# EAGLE design parallelmonitor (EAGLE 6.2)
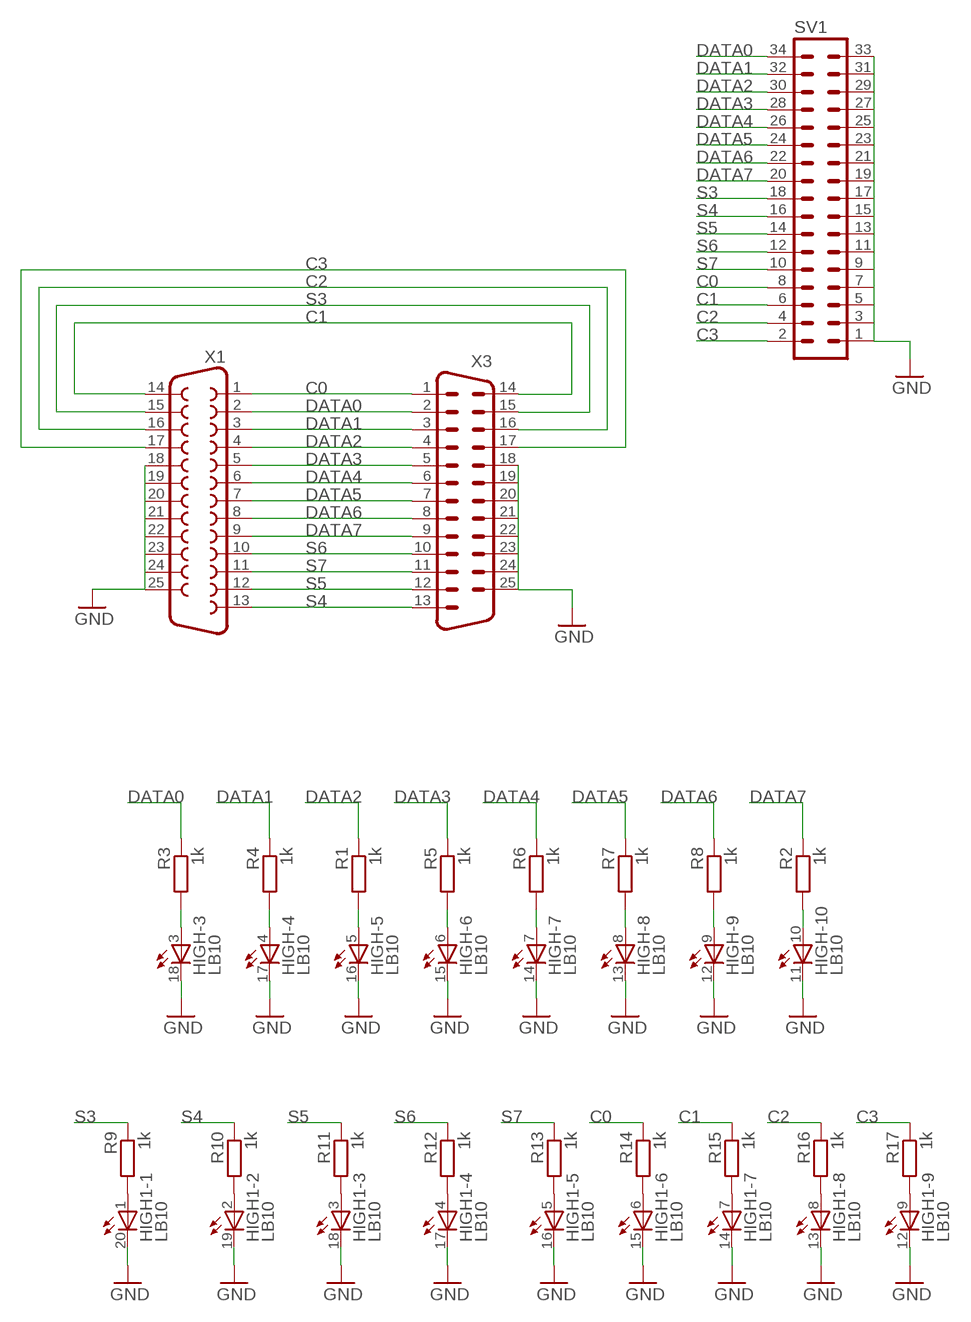
[diagram p0: schematic, sheet 1]

## Parts
HIGH  LB10  [LB10]
HIGH1  LB10  [LB10]
R1  1k  R-EU_M0805  [M0805]
R2  1k  R-EU_M0805  [M0805]
R3  1k  R-EU_M0805  [M0805]
R4  1k  R-EU_M0805  [M0805]
R5  1k  R-EU_M0805  [M0805]
R6  1k  R-EU_M0805  [M0805]
R7  1k  R-EU_M0805  [M0805]
R8  1k  R-EU_M0805  [M0805]
R9  1k  R-EU_M0805  [M0805]
R10  1k  R-EU_M0805  [M0805]
R11  1k  R-EU_M0805  [M0805]
R12  1k  R-EU_M0805  [M0805]
R13  1k  R-EU_M0805  [M0805]
R14  1k  R-EU_M0805  [M0805]
R15  1k  R-EU_M0805  [M0805]
R16  1k  R-EU_M0805  [M0805]
R17  1k  R-EU_M0805  [M0805]
SV1  MA17-2W  [MA17-2W]
X1  F25D  [F25D]
X3  M25D  [M25D]

## Nets
C0: R14.1 SV1.8 X1.1 X3.1
C1: R15.1 SV1.6 X1.14 X3.14
C2: R16.1 SV1.4 X1.16 X3.16
C3: R17.1 SV1.2 X1.17 X3.17
DATA0: R3.1 SV1.34 X1.2 X3.2
DATA1: R4.1 SV1.32 X1.3 X3.3
DATA2: R1.1 SV1.30 X1.4 X3.4
DATA3: R5.1 SV1.28 X1.5 X3.5
DATA4: R6.1 SV1.26 X1.6 X3.6
DATA5: R7.1 SV1.24 X1.7 X3.7
DATA6: R8.1 SV1.22 X1.8 X3.8
DATA7: R2.1 SV1.20 X1.9 X3.9
GND: HIGH1.12(-9:C) HIGH1.13(-8:C) HIGH1.14(-7:C) HIGH1.15(-6:C) HIGH1.16(-5:C) HIGH1.17(-4:C) HIGH1.18(-3:C) HIGH1.19(-2:C) HIGH1.20(-1:C) HIGH.11(-10:C) HIGH.12(-9:C) HIGH.13(-8:C) HIGH.14(-7:C) HIGH.15(-6:C) HIGH.16(-5:C) HIGH.17(-4:C) HIGH.18(-3:C) SV1.1 SV1.3 SV1.5 SV1.7 SV1.9 SV1.11 SV1.13 SV1.15 SV1.17 SV1.19 SV1.21 SV1.23 SV1.25 SV1.27 SV1.29 SV1.31 SV1.33 X1.18 X1.19 X1.20 X1.21 X1.22 X1.23 X1.24 X1.25 X3.18 X3.19 X3.20 X3.21 X3.22 X3.23 X3.24 X3.25
N$1: HIGH.10(-10:A) R2.2
N$2: HIGH1.1(-1:A) R9.2
N$3: HIGH.3(-3:A) R3.2
N$4: HIGH.4(-4:A) R4.2
N$5: HIGH.6(-6:A) R5.2
N$6: HIGH.5(-5:A) R1.2
N$7: HIGH.7(-7:A) R6.2
N$8: HIGH.8(-8:A) R7.2
N$9: HIGH.9(-9:A) R8.2
N$10: HIGH1.2(-2:A) R10.2
N$11: HIGH1.3(-3:A) R11.2
N$12: HIGH1.4(-4:A) R12.2
N$13: HIGH1.5(-5:A) R13.2
N$14: HIGH1.6(-6:A) R14.2
N$15: HIGH1.7(-7:A) R15.2
N$16: HIGH1.8(-8:A) R16.2
N$17: HIGH1.9(-9:A) R17.2
S3: R9.1 SV1.18 X1.15 X3.15
S4: R10.1 SV1.16 X1.13 X3.13
S5: R11.1 SV1.14 X1.12 X3.12
S6: R12.1 SV1.12 X1.10 X3.10
S7: R13.1 SV1.10 X1.11 X3.11
Unconnected: HIGH1.10(-10:A) HIGH1.11(-10:C) HIGH.1(-1:A) HIGH.2(-2:A) HIGH.19(-2:C) HIGH.20(-1:C)

## Library data of the parts
HIGH HIGH1 = led:LB10: LED BLOCK 10-LED bar graph, DIL, Siemens
R1-R17 = rcl:R-EU_: RESISTOR, European symbol
SV1 = con-lstb:MA17-2W: PIN HEADER
X1 = con-subd:F25: SUB-D
X3 = con-subd:M25: SUB-D

## Board
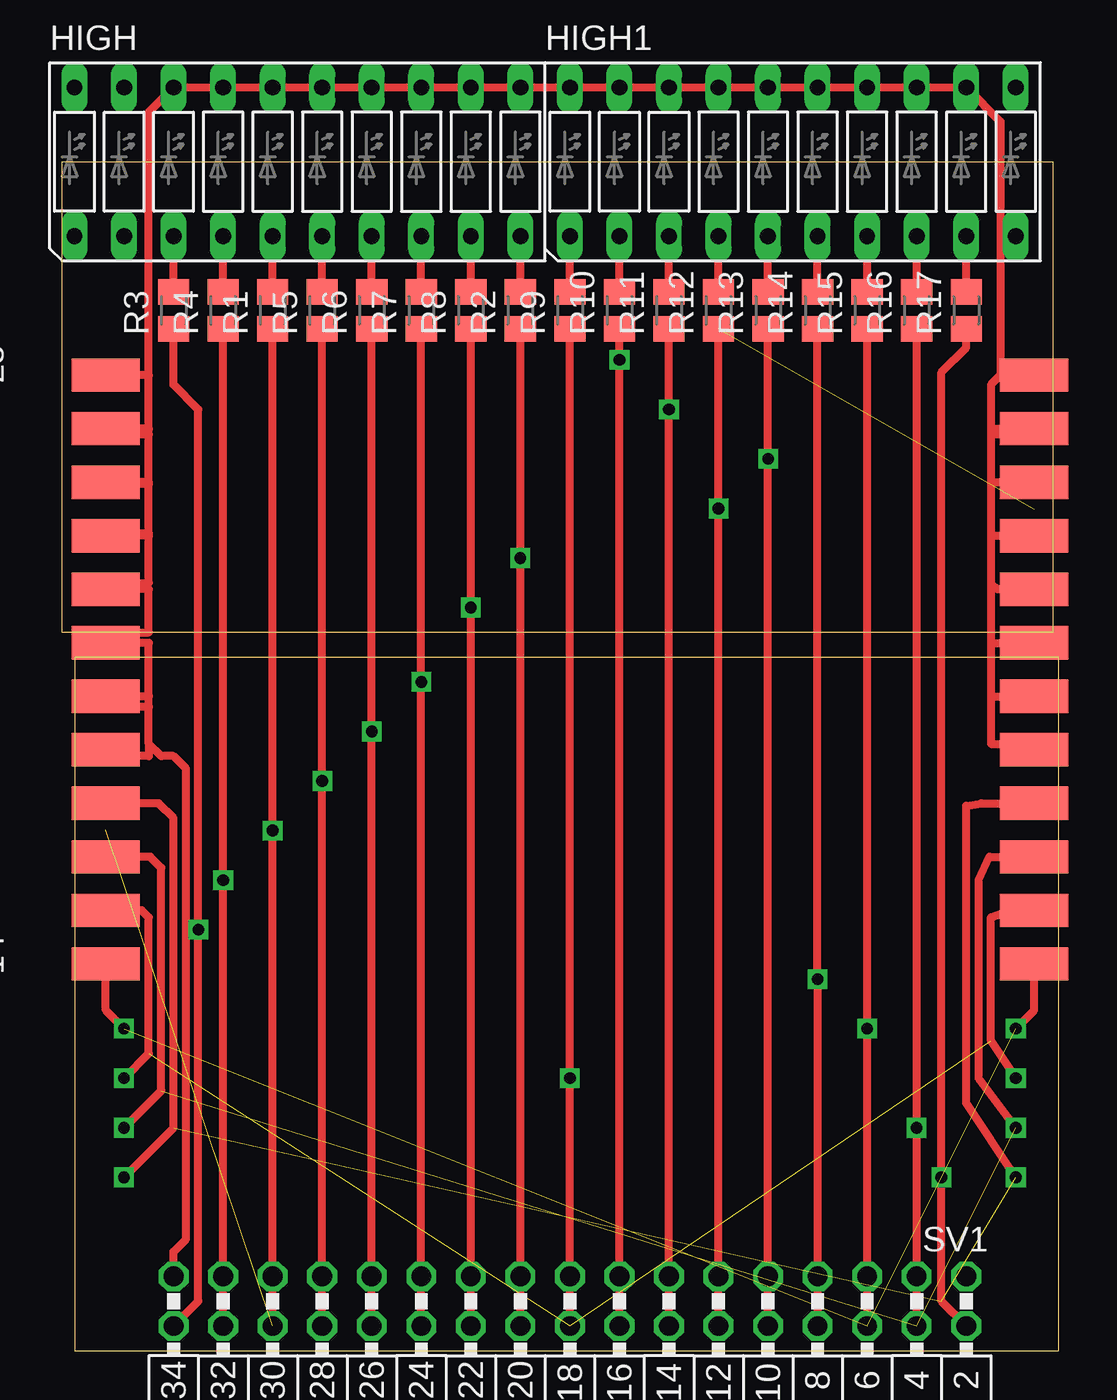
[diagram p1: board, top side]
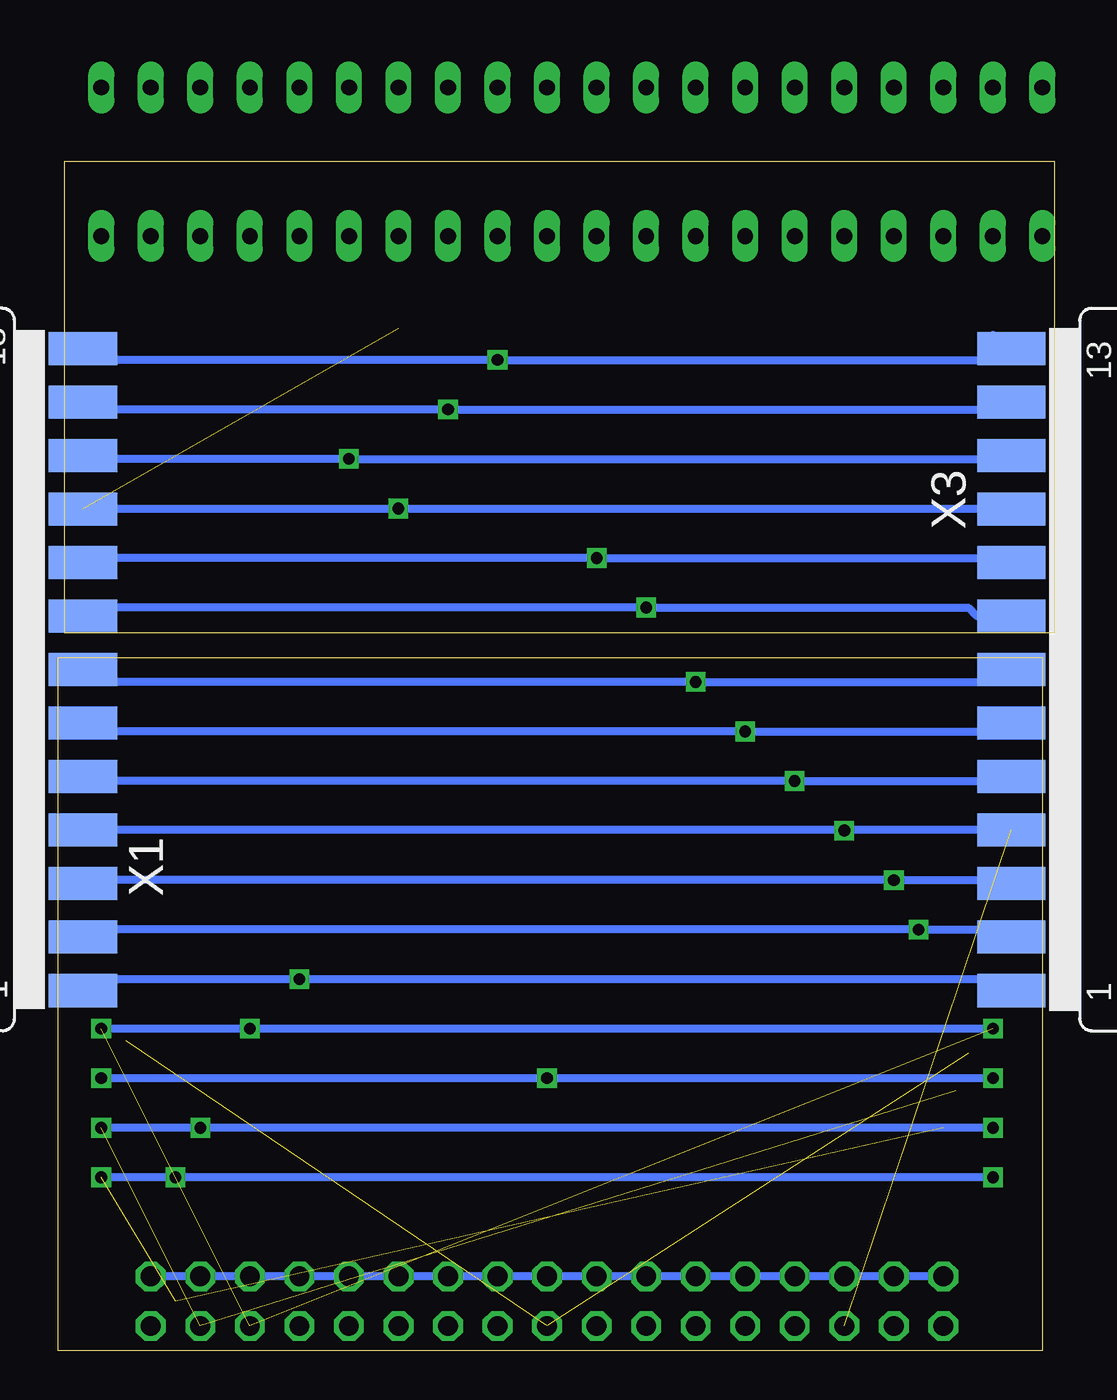
[diagram p2: board, bottom side, seen from below]

Size 51.1 x 60.96 mm. Coordinates in mm from the lower left corner, seen from the top.
Outline: 0.64,0 51.1,0 51.1,35.55 0.64,35.55 0.64,0
Outline: 0,60.96 50.8,60.96 50.8,36.83 0,36.83 0,60.96
Copper layers (1*16): Top 0.035mm / dielectric 1.5mm / Bottom 0.035mm
Design rules "default": minimum track width 10mil, minimum drill 24mil, track to track 8mil, track to pad 8mil, pad to pad 8mil, via to via 8mil, smd to smd 8mil, copper to edge 40mil, drill to drill 8mil, minimum pad ring 10mil, minimum via ring 8mil, stop-mask expansion 4mil, vias tented up to drill 0mil, thermal gap 10mil

### Footprints (pad centres in the part's own frame; a part is rotated, then mirrored left to right if it is on the bottom)
LB10 = drill 0.813 long: 1 -11.43,-3.81; 2 -8.89,-3.81; 3 -6.35,-3.81; 4 -3.81,-3.81; 5 -1.27,-3.81; 6 1.27,-3.81; 7 3.81,-3.81; 8 6.35,-3.81; 9 8.89,-3.81; 10 11.43,-3.81; 11 11.43,3.81; 12 8.89,3.81; 13 6.35,3.81; 14 3.81,3.81; 15 1.27,3.81; 16 -1.27,3.81; 17 -3.81,3.81; 18 -6.35,3.81; 19 -8.89,3.81; 20 -11.43,3.81
M0805 = smd 1.3 x 1.6: 1 -0.95,0; 2 0.95,0
MA17-2W = drill 1.016 octagon: 1 -20.32,-1.27; 2 -20.32,1.27; 3 -17.78,-1.27; 4 -17.78,1.27; 5 -15.24,-1.27; 6 -15.24,1.27; 7 -12.7,-1.27; 8 -12.7,1.27; 9 -10.16,-1.27; 10 -10.16,1.27; 11 -7.62,-1.27; 12 -7.62,1.27; 13 -5.08,-1.27; 14 -5.08,1.27; 15 -2.54,-1.27; 16 -2.54,1.27; 17 0,-1.27; 18 0,1.27; 19 2.54,-1.27; 20 2.54,1.27; 21 5.08,-1.27; 22 5.08,1.27; 23 7.62,-1.27; 24 7.62,1.27; 25 10.16,-1.27; 26 10.16,1.27; 27 12.7,-1.27; 28 12.7,1.27; 29 15.24,-1.27; 30 15.24,1.27; 31 17.78,-1.27; 32 17.78,1.27; 33 20.32,-1.27; 34 20.32,1.27
F25D = smd 1.7 x 3.5: 1 -16.459,-6.045; 2 -13.716,-6.045; 3 -10.973,-6.045; 4 -8.23,-6.045; 5 -5.486,-6.045; 6 -2.743,-6.045; 7 0,-6.045; 8 2.743,-6.045; 9 5.486,-6.045; 10 8.23,-6.045; 11 10.973,-6.045; 12 13.716,-6.045; 13 16.459,-6.045 | smd 1.7 x 3.5 bottom: 14 -15.088,-6.045; 15 -12.344,-6.045; 16 -9.601,-6.045; 17 -6.858,-6.045; 18 -4.115,-6.045; 19 -1.372,-6.045; 20 1.372,-6.045; 21 4.115,-6.045; 22 6.858,-6.045; 23 9.601,-6.045; 24 12.344,-6.045; 25 15.088,-6.045
M25D = smd 1.7 x 3.5: 1 16.459,-6.045; 2 13.716,-6.045; 3 10.973,-6.045; 4 8.23,-6.045; 5 5.486,-6.045; 6 2.743,-6.045; 7 0,-6.045; 8 -2.743,-6.045; 9 -5.486,-6.045; 10 -8.23,-6.045; 11 -10.973,-6.045; 12 -13.716,-6.045; 13 -16.459,-6.045 | smd 1.7 x 3.5 bottom: 14 15.088,-6.045; 15 12.344,-6.045; 16 9.601,-6.045; 17 6.858,-6.045; 18 4.115,-6.045; 19 1.372,-6.045; 20 -1.372,-6.045; 21 -4.115,-6.045; 22 -6.858,-6.045; 23 -9.601,-6.045; 24 -12.344,-6.045; 25 -15.088,-6.045

### Placement (x,y rotation side)
HIGH  12.06,60.96 0 top
HIGH1  37.46,60.96 0 top
R1  10.79,53.34 90 top
R2  23.5,53.34 90 top
R3  5.71,53.34 90 top
R4  8.26,53.34 90 top
R5  13.33,53.34 90 top
R6  15.88,53.34 90 top
R7  18.42,53.34 90 top
R8  20.96,53.34 90 top
R9  26.04,53.34 90 top
R10  28.58,53.34 90 top
R11  31.12,53.34 90 top
R12  33.66,53.34 90 top
R13  36.2,53.34 90 top
R14  38.73,53.34 90 top
R15  41.27,53.34 90 top
R16  43.81,53.34 90 top
R17  46.35,53.34 90 top
SV1  26.04,2.54 180 top
X1  55.88,34.92 90 bottom
X3  -3.81,34.92 270 bottom

### Tracks (layer width: path | path; a pad name or v marks a point on that pad's centre or on a via)
C0  (via drill 0.6)
  Top 0.406: R14.1 v38.73,19.05 SV1.8
  Bottom 0.406: X1.1 49.48,18.47 48.89,19.05 v38.73,19.05 3.17,19.05 2.59,18.47 X3.1
C1  (2 unrouted)
  Top 0.406: X1.14 49.84,17.45 48.89,16.51 | X3.14 2.24,17.45 3.17,16.51 | SV1.6 R15.1
C2  (2 unrouted)
  Top 0.406: X1.16 47.55,25.32 46.99,24.13 46.99,13.97 48.89,11.43 | X3.16 4.52,25.32 5.08,24.77 5.08,13.33 3.17,11.43 | SV1.4 R16.1
C3  (2 unrouted)
  Top 0.406: X1.17 47.12,28.07 46.35,27.94 46.35,12.7 48.89,8.89 | X3.17 4.95,28.07 5.71,27.3 5.71,11.43 3.17,8.89 | SV1.2 45.09,2.54 45.09,50.16 46.35,51.43 R17.1
DATA0  (via drill 0.6)
  Top 0.406: R3.1 5.71,49.53 6.98,48.26 v6.98,21.59 6.98,2.54 SV1.34
  Bottom 0.406: X3.2 2.79,21.21 3.17,21.59 v6.98,21.59 49.45,21.59 X1.2
DATA1  (via drill 0.6)
  Top 0.406: R4.1 v8.26,24.13 SV1.32
  Bottom 0.406: X3.3 3,23.95 3.17,24.13 v8.26,24.13 49.66,24.13 X1.3
DATA2  (1 unrouted)
  Top 0.406: SV1.30 R1.1
  Bottom 0.406: X3.4 X1.4
DATA3  (via drill 0.6)
  Top 0.406: R5.1 v13.33,29.21 SV1.28
  Bottom 0.406: X3.5 2.46,29.21 v13.33,29.21 49.61,29.21 X1.5
DATA4  (via drill 0.6)
  Top 0.406: R6.1 v15.88,31.75 SV1.26
  Bottom 0.406: X3.6 2.74,32.18 3.17,31.75 v15.88,31.75 49.4,31.75 X1.6
DATA5  (via drill 0.6)
  Top 0.406: R7.1 v18.42,34.29 SV1.24
  Bottom 0.406: 2.87,34.29 X3.7 2.54,34.92 3.17,34.29 v18.42,34.29 48.89,34.29 49.53,34.92 X1.7
DATA6  (via drill 0.6)
  Top 0.406: R8.1 v20.96,38.1 SV1.22
  Bottom 0.406: X3.8 4.01,37.67 4.45,38.1 v20.96,38.1 49.4,38.1 X1.8
DATA7  (via drill 0.6)
  Top 0.406: R2.1 v23.5,40.64 SV1.20
  Bottom 0.406: X3.9 3.58,40.41 3.81,40.64 v23.5,40.64 49.61,40.64 X1.9
GND
  Top 0.406: 4.45,50.01 X3.25 | 4.45,50.01 4.45,46.99 2.24,46.99 X3.24 4.45,47.27 4.45,44.45 2.24,44.45 X3.23 4.45,44.53 4.45,41.91 2.24,41.91 X3.22 4.45,41.78 4.45,39.37 2.24,39.37 X3.21 4.45,39.04 4.45,36.83 2.24,36.83 X3.20 4.45,36.3 4.45,33.02 2.24,33.02 X3.19 4.45,33.55 4.45,31.11 | 4.45,31.11 4.45,30.48 2.24,30.48 X3.18 | 48.11,50.01 X1.25 | 48.11,50.01 47.62,49.53 47.62,46.99 | 47.62,46.99 49.55,46.99 X1.24 47.9,47.27 47.62,46.99 | 47.62,33.66 47.62,31.11 48.26,31.11 48.89,30.48 49.5,30.48 X1.18 | 47.62,36.2 47.62,33.66 | 47.62,39.37 47.62,36.2 | 47.62,41.91 47.62,39.37 | 47.62,44.45 47.62,41.91 | 47.62,46.99 47.62,44.45 | X1.19 47.73,33.55 47.62,33.66 | X1.20 47.73,36.3 47.62,36.2 | X1.21 47.95,39.04 47.62,39.37 | X1.22 47.75,41.78 47.62,41.91 | X1.23 47.7,44.53 47.62,44.45 | 4.45,50.01 4.45,63.5 HIGH.18 HIGH.17 HIGH.16 HIGH.15 HIGH.14 HIGH.13 HIGH.12 HIGH.11 HIGH1.20 HIGH1.19 HIGH1.18 HIGH1.17 HIGH1.16 HIGH1.15 HIGH1.14 HIGH1.13 HIGH1.12 48.11,63.02 48.11,50.01 | SV1.33 5.71,5.08 6.35,5.71 6.35,29.85 5.71,30.48 5.08,30.48 4.45,31.11
  Bottom 0.406: SV1.33 SV1.31 SV1.29 SV1.27 SV1.25 SV1.23 SV1.21 SV1.19 SV1.17 SV1.15 SV1.13 SV1.11 SV1.9 SV1.7 SV1.5 SV1.3 SV1.1
N$1
  Top 0.406: R2.2 HIGH.10
N$2
  Top 0.406: R9.2 HIGH1.1
N$3
  Top 0.406: R3.2 HIGH.3
N$4
  Top 0.406: R4.2 HIGH.4
N$5
  Top 0.406: R5.2 HIGH.6
N$6
  Top 0.406: R1.2 HIGH.5
N$7
  Top 0.406: R6.2 HIGH.7
N$8
  Top 0.406: R7.2 HIGH.8
N$9
  Top 0.406: R8.2 HIGH.9
N$10
  Top 0.406: R10.2 HIGH1.2
N$11
  Top 0.406: R11.2 HIGH1.3
N$12
  Top 0.406: R12.2 HIGH1.4
N$13
  Top 0.406: R13.2 HIGH1.5
N$14
  Top 0.406: R14.2 HIGH1.6
N$15
  Top 0.406: R15.2 HIGH1.7
N$16
  Top 0.406: R16.2 HIGH1.8
N$17
  Top 0.406: R17.2 HIGH1.9
N$18  (via drill 0.6)
  other vias: 10.79,26.67
N$19  (via drill 0.6)
  other vias: 33.66,43.18
N$21  (via drill 0.6)
  Bottom 0.406: v3.17,13.97 v26.04,13.97 v48.89,13.97
N$23  (via drill 0.6)
  Bottom 0.406: v48.89,8.89 v45.09,8.89 v3.17,8.89
N$24  (via drill 0.6)
  Bottom 0.406: v3.17,16.51 v41.27,16.51 v48.89,16.51
N$26  (via drill 0.6)
  Bottom 0.406: v3.17,11.43 v43.81,11.43 v48.89,11.43
S3  (2 unrouted)
  Top 0.406: X1.15 48.62,22.58 47.62,22.23 47.62,15.87 48.89,13.97 | X3.15 4.09,22.58 4.45,22.23 4.45,15.24 3.17,13.97 | SV1.18 R9.1
S4  (via drill 0.6)
  Top 0.406: R10.1 v28.58,50.8 SV1.16
  Bottom 0.406: X3.13 2.49,51.38 3.17,52.07 3.17,51.43 3.81,50.8 v28.58,50.8 49.53,50.8 49.53,51.08 X1.13
S5  (via drill 0.6)
  Top 0.406: R11.1 v31.12,48.26 SV1.14
  Bottom 0.406: X3.12 3.43,48.64 3.81,48.26 v31.12,48.26 50.16,48.26 50.16,48.31 X1.12
S6  (1 unrouted)
  Top 0.406: SV1.12 R12.1
  Bottom 0.406: X3.10 X1.10
S7  (via drill 0.6)
  Top 0.406: R13.1 v36.2,45.72 SV1.10
  Bottom 0.406: X3.11 3.63,45.9 3.81,45.72 v36.2,45.72 49.66,45.72 X1.11